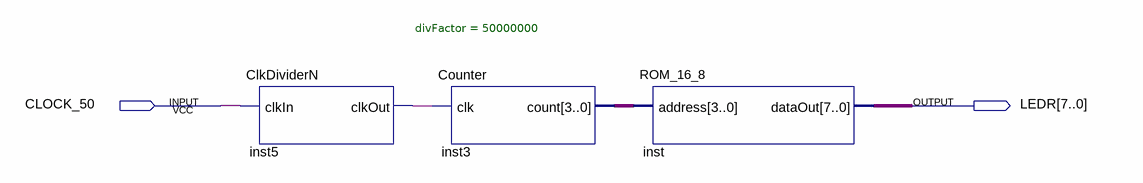
[diagram p0: schematic sheet]
// Quartus schematic ROM_Demo.bdf as structural Verilog: 3 symbols, 2 pins
module ROM_Demo (
  input  CLOCK_50,
  output [7:0] LEDR
);

  wire inst5_clkout;
  wire [3:0] inst3_count;

  ClkDividerN #(.divFactor(50000000)) inst5 (.clkIn(CLOCK_50), .clkOut(inst5_clkout));
  Counter inst3 (.clk(inst5_clkout), .count(inst3_count));
  ROM_16_8 inst (.address(inst3_count), .dataOut(LEDR));
endmodule
